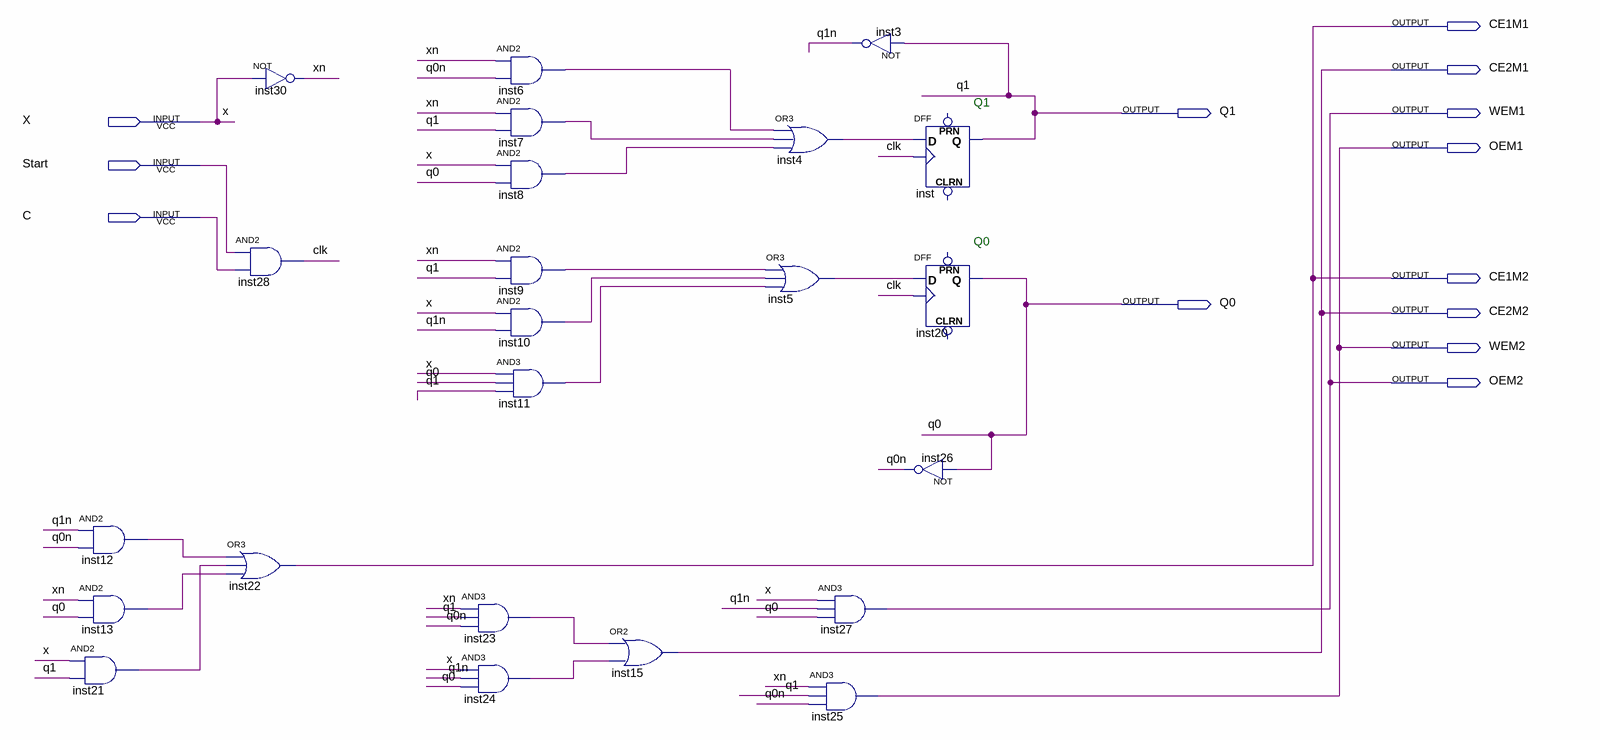
[diagram p0: schematic sheet]
// Quartus schematic Maquina_Estado_Seniales.bdf as structural Verilog: 23 symbols, 13 pins
module Maquina_Estado_Seniales (
  input  X,
  input  Start,
  input  C,
  output CE1M1,
  output CE2M1,
  output Q1,
  output WEM1,
  output OEM1,
  output CE1M2,
  output Q0,
  output CE2M2,
  output WEM2,
  output OEM2
);

  wire clk, inst4_out, inst5_out, inst6_out, inst7_out, inst8_out, inst9_out, inst10_out, inst11_out,
       inst12_out, inst13_out, inst21_out, inst23_out, inst24_out, q0n, q1n, xn;

  and inst12 (inst12_out, q1n, q0n);
  and inst13 (inst13_out, xn, Q0);
  and inst21 (inst21_out, X, Q1);
  not inst30 (xn, X);
  and inst28 (clk, Start, C);
  or inst22 (CE1M1, inst12_out, inst21_out, inst13_out);
  and inst6 (inst6_out, xn, q0n);
  and inst7 (inst7_out, xn, Q1);
  and inst8 (inst8_out, X, Q0);
  and inst9 (inst9_out, xn, Q1);
  and inst10 (inst10_out, X, q1n);
  and inst11 (inst11_out, X, Q0, Q1);
  and inst23 (inst23_out, xn, Q1, q0n);
  and inst24 (inst24_out, X, q1n, Q0);
  or inst15 (CE2M1, inst23_out, inst24_out);
  or inst4 (inst4_out, inst6_out, inst7_out, inst8_out);
  or inst5 (inst5_out, inst9_out, inst10_out, inst11_out);
  and inst27 (OEM2, X, q1n, Q0);
  and inst25 (OEM1, xn, Q1, q0n);
  not inst3 (q1n, Q1);
  DFF inst (.CLK(clk), .D(inst4_out), .Q(Q1));  // open: CLRN, PRN
  DFF inst20 (.CLK(clk), .D(inst5_out), .Q(Q0));  // open: CLRN, PRN
  not inst26 (q0n, Q0);

  assign CE1M2 = CE1M1;
  assign CE2M2 = CE2M1;
  assign WEM1 = OEM2;
  assign WEM2 = OEM1;

  // Notes on the sheet:
  //   Q1
  //   Q0
endmodule
